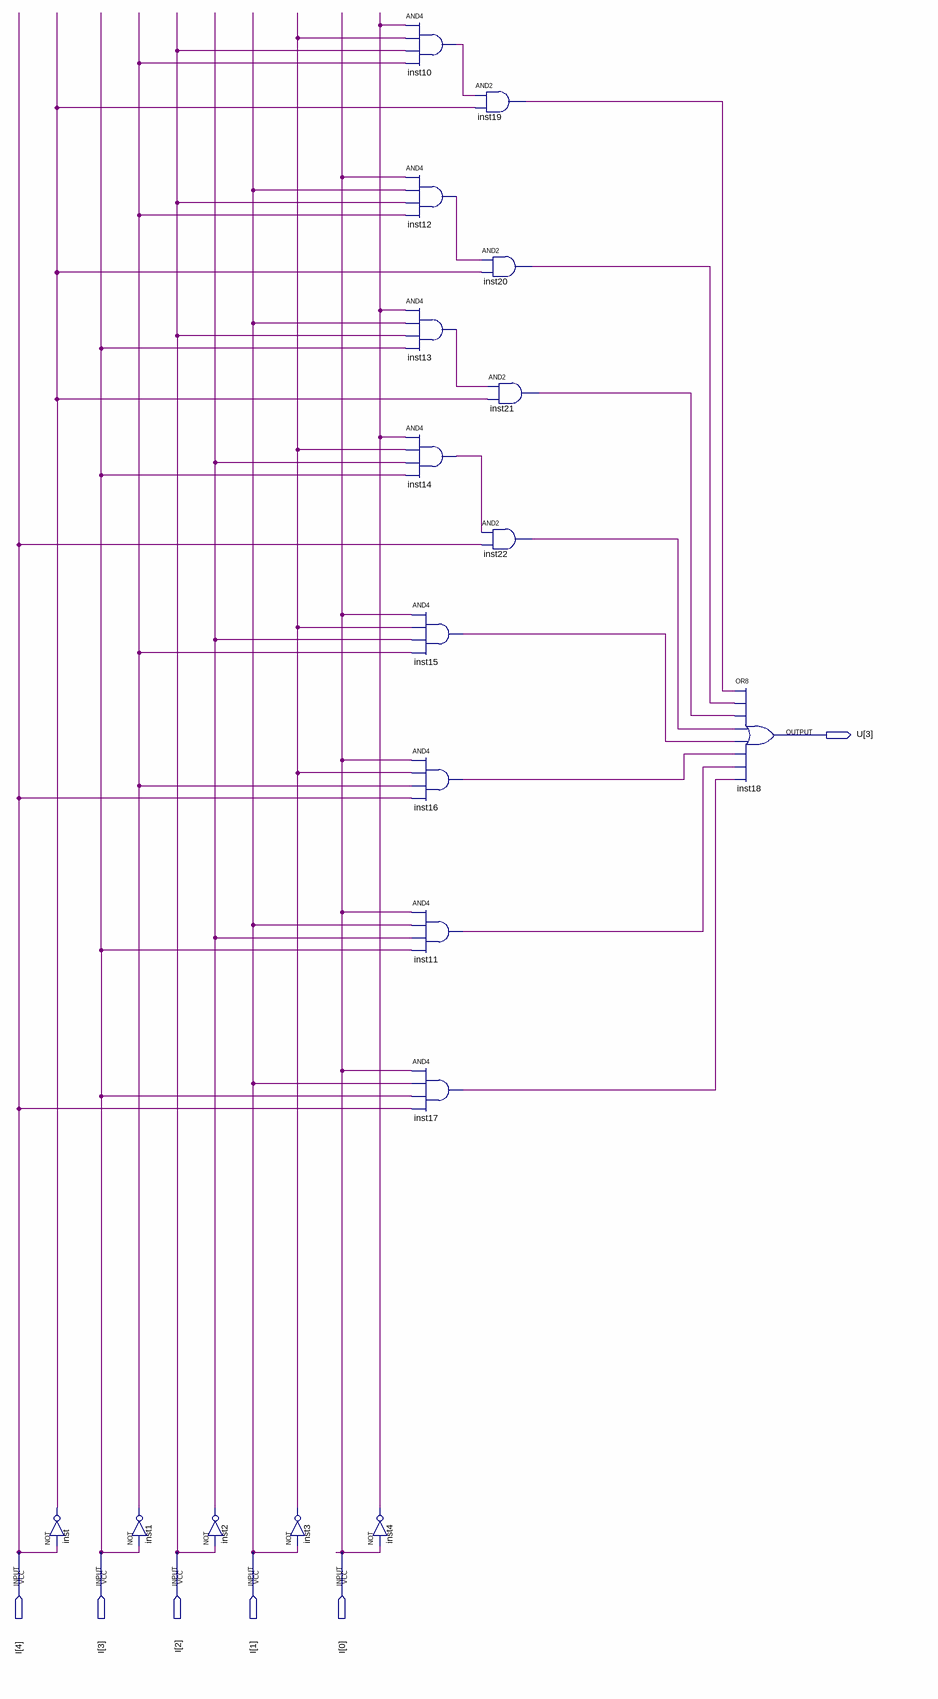
[diagram p0: schematic sheet]
// Quartus schematic BCD_d_Segment.bdf as structural Verilog: 18 symbols, 6 pins
module BCD_d_Segment (
  input  [4:0] I,
  output [3:3] U
);

  wire inst1_out, inst2_out, inst3_out, inst4_out, inst10_out, inst11_out, inst12_out, inst13_out,
       inst14_out, inst15_out, inst16_out, inst17_out, inst19_out, inst20_out, inst21_out, inst22_out,
       inst_out;

  not inst (inst_out, I[4]);
  not inst1 (inst1_out, I[3]);
  not inst2 (inst2_out, I[2]);
  not inst3 (inst3_out, I[1]);
  and inst10 (inst10_out, inst4_out, inst3_out, I[2], inst1_out);
  and inst12 (inst12_out, I[0], I[1], I[2], inst1_out);
  and inst13 (inst13_out, inst4_out, I[1], I[2], I[3]);
  and inst14 (inst14_out, inst4_out, inst3_out, inst2_out, I[3]);
  and inst15 (inst15_out, I[0], inst3_out, inst2_out, inst1_out);
  and inst16 (inst16_out, I[0], inst3_out, inst1_out, I[4]);
  and inst11 (inst11_out, I[0], I[1], inst2_out, I[3]);
  and inst17 (inst17_out, I[0], I[1], I[3], I[4]);
  not inst4 (inst4_out, I[0]);
  and inst19 (inst19_out, inst10_out, inst_out);
  and inst20 (inst20_out, inst12_out, inst_out);
  and inst21 (inst21_out, inst13_out, inst_out);
  and inst22 (inst22_out, inst14_out, I[4]);
  or inst18 (U[3], inst19_out, inst20_out, inst21_out, inst22_out, inst15_out, inst16_out, inst11_out, inst17_out);
endmodule
